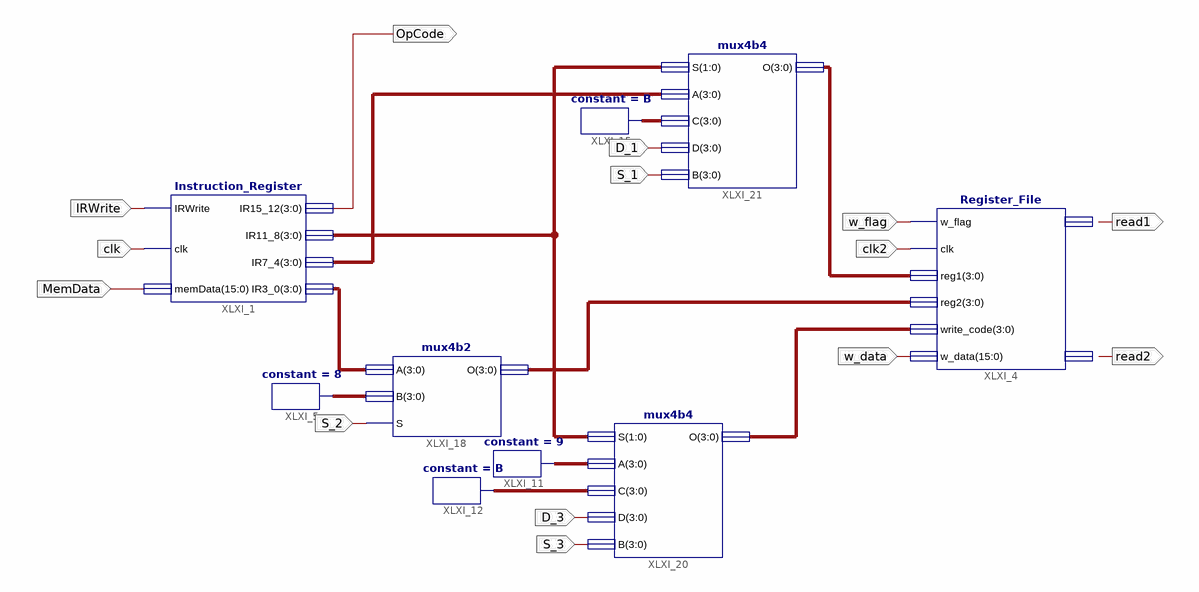
[diagram p0: schematic sheet 1]
// Xilinx ISE schematic Processor_Tim.sch (spartan3e) as structural Verilog: 9 symbols, 14 ports
module Processor_Tim (
  input  MemData,
  input  IRWrite,
  input  clk,
  input  D_1,
  input  S_1,
  input  w_flag,
  input  clk2,
  input  w_data,
  input  D_3,
  input  S_3,
  input  S_2,
  output OpCode,
  output read1,
  output read2
);

  wire [3:0] XLXN_3, XLXN_25, XLXN_26;
  wire [15:0] XLXN_4, XLXN_5, XLXN_6, XLXN_33, XLXN_40, XLXN_41, XLXN_62;

  Instruction_Register XLXI_1 (
    .IRWrite(IRWrite), .clk(clk), .memData({16{MemData}}), .IR15_12({4{OpCode}}), .IR11_8(XLXN_25),
    .IR7_4(XLXN_26), .IR3_0(XLXN_3));
  Register_File XLXI_4 (
    .w_flag(w_flag), .clk(clk2), .reg1(XLXN_4), .reg2(XLXN_5), .write_code(XLXN_62), .w_data({16{w_data}}));  // open: read1, read2
  constant #(.CValue("8")) XLXI_5 (.O(XLXN_6));
  constant #(.CValue("9")) XLXI_11 (.O(XLXN_40));
  constant #(.CValue("B")) XLXI_12 (.O(XLXN_41));
  constant #(.CValue("B")) XLXI_15 (.O(XLXN_33));
  mux4b2 XLXI_18 (.A(XLXN_3), .B(XLXN_6), .S(S_2), .O(XLXN_5));
  mux4b4 XLXI_20 (.D({4{D_3}}), .C(XLXN_41), .A(XLXN_40), .B({4{S_3}}), .S(XLXN_25), .O(XLXN_62));
  mux4b4 XLXI_21 (.D({4{D_1}}), .C(XLXN_33), .A(XLXN_26), .B({4{S_1}}), .S(XLXN_25), .O(XLXN_4));
endmodule
